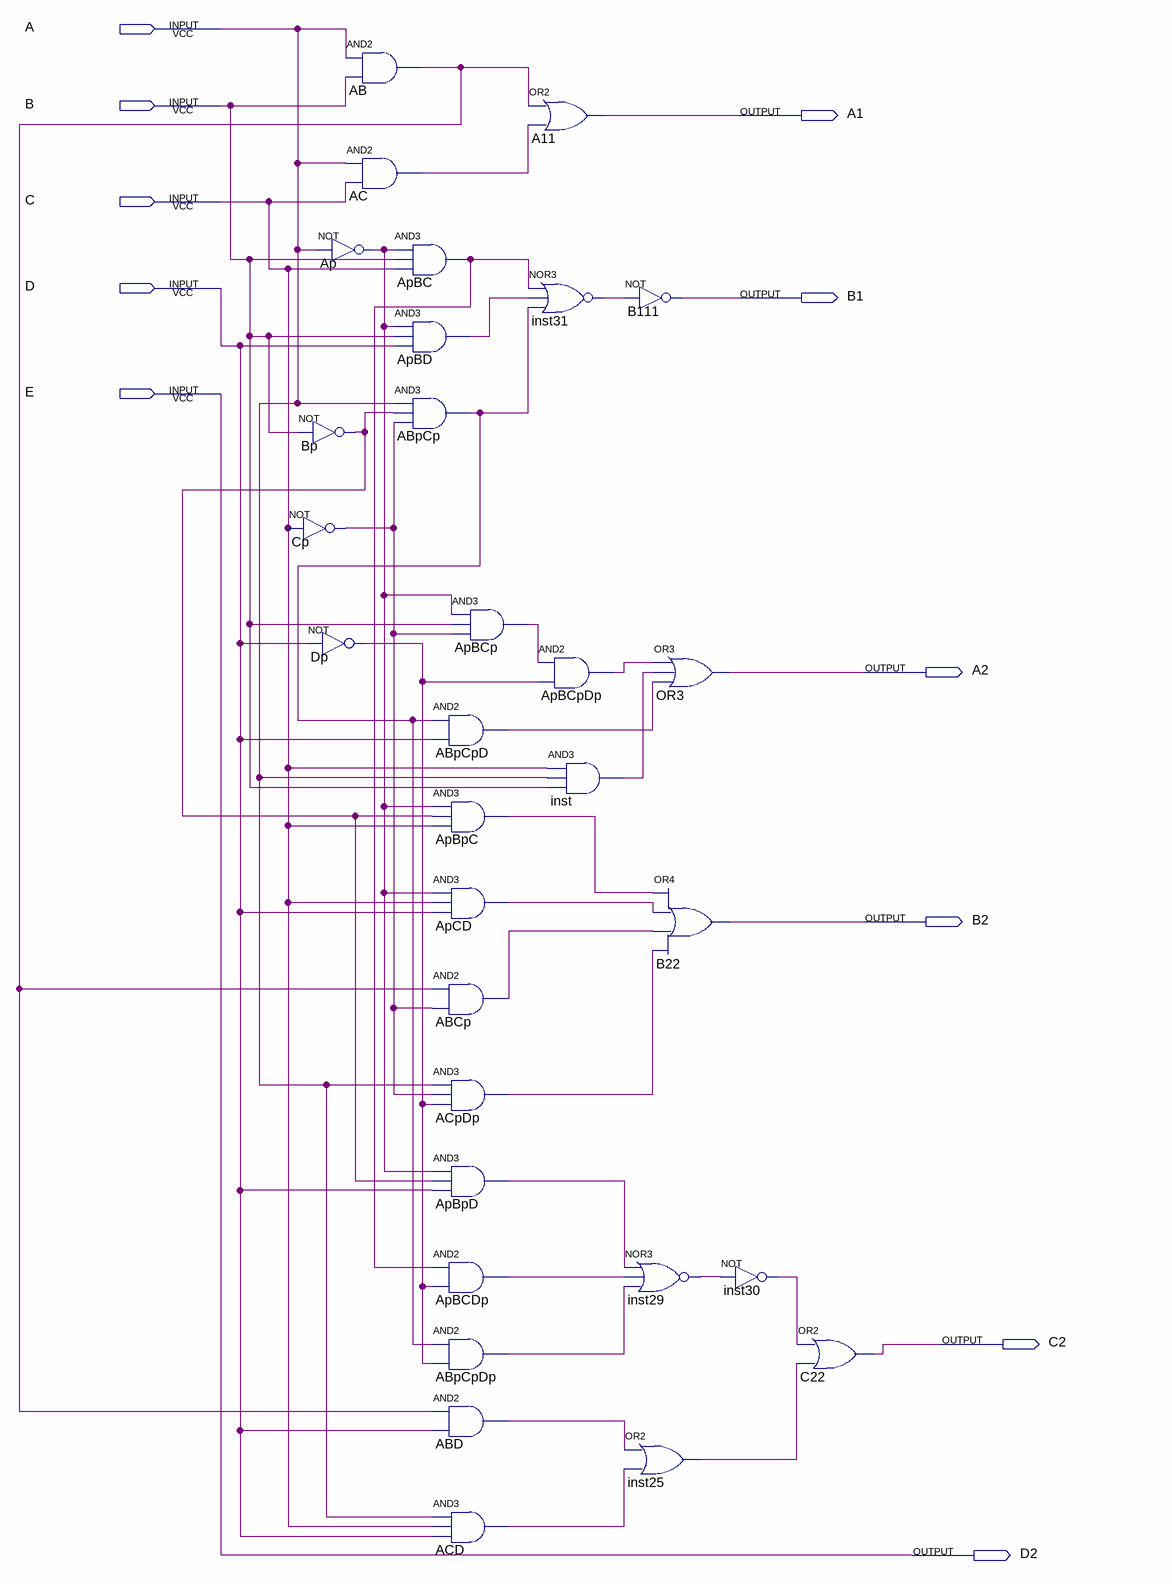
[diagram p0: schematic sheet]
// Quartus schematic Jason.bdf as structural Verilog: 31 symbols, 11 pins
module Jason (
  input  A,
  input  B,
  input  C,
  input  D,
  input  E,
  output A1,
  output B1,
  output A2,
  output B2,
  output C2,
  output D2
);

  wire AB_out, ABCp_out, ABD_out, ABpCp_out, ABpCpD_out, ABpCpDp_out, AC_out, ACD_out, ACpDp_out, Ap_out,
       ApBC_out, ApBCDp_out, ApBCp_out, ApBCpDp_out, ApBD_out, ApBpC_out, ApBpD_out, ApCD_out, Bp_out,
       Cp_out, Dp_out, inst25_out, inst29_out, inst30_out, inst31_out, inst_out;

  not Bp (Bp_out, B);
  not Cp (Cp_out, C);
  and AB (AB_out, A, B);
  and AC (AC_out, A, C);
  not Ap (Ap_out, A);
  not Dp (Dp_out, D);
  and ApBC (ApBC_out, Ap_out, B, C);
  and ApBD (ApBD_out, Ap_out, B, D);
  and ABpCp (ABpCp_out, A, Bp_out, Cp_out);
  and ApBCp (ApBCp_out, Ap_out, B, Cp_out);
  and ABpCpD (ABpCpD_out, ABpCp_out, D);
  and ApBpC (ApBpC_out, Ap_out, Bp_out, C);
  and ApCD (ApCD_out, Ap_out, C, D);
  and ABCp (ABCp_out, AB_out, Cp_out);
  and ACpDp (ACpDp_out, A, Cp_out, Dp_out);
  and ApBpD (ApBpD_out, Ap_out, Bp_out, D);
  and ApBCDp (ApBCDp_out, ApBC_out, Dp_out);
  and ABpCpDp (ABpCpDp_out, ABpCp_out, Dp_out);
  and ABD (ABD_out, AB_out, D);
  and ACD (ACD_out, A, C, D);
  or A11 (A1, AB_out, AC_out);
  nor inst31 (inst31_out, ApBC_out, ApBD_out, ABpCp_out);
  and ApBCpDp (ApBCpDp_out, ApBCp_out, Dp_out);
  and inst (inst_out, C, A, B);
  not B111 (B1, inst31_out);
  or OR3 (A2, ApBCpDp_out, inst_out, ABpCpD_out);
  or B22 (B2, ApBpC_out, ApCD_out, ABCp_out, ACpDp_out);
  nor inst29 (inst29_out, ApBpD_out, ApBCDp_out, ABpCpDp_out);
  or inst25 (inst25_out, ABD_out, ACD_out);
  not inst30 (inst30_out, inst29_out);
  or C22 (C2, inst30_out, inst25_out);

  assign D2 = E;
endmodule
